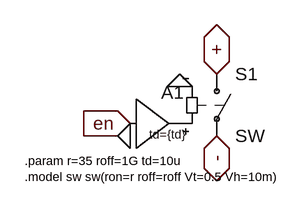
[diagram p0: schematic active_discharge.asc]
active_discharge.asc, the LTspice schematic file:
Version 4
SHEET 1 880 680
FLAG 144 112 +
IOPIN 144 112 BiDir
FLAG 96 128 0
FLAG 32 176 en
IOPIN 32 176 In
FLAG 32 192 0
FLAG 144 192 -
IOPIN 144 192 BiDir
SYMBOL sw 144 96 R0
SYMATTR InstName S1
SYMBOL Digital\\buf1 32 112 R0
WINDOW 3 25 78 Left 1
SYMATTR Value td={td}
SYMATTR InstName A1
TEXT -104 224 Left 1 !.param r=35 roff=1G td=10u\n.model sw sw(ron=r roff=roff Vt=0.5 Vh=10m)

The netlist it stands for:
* active_discharge.asc
S1 + - P001 0 SW
A1 en 0 0 0 0 0 P001 0 BUF td={td}
.param r=35 roff=1G td=10u
.model sw sw(ron=r roff=roff Vt=0.5 Vh=10m)
.backanno
.end